# Altium schematic sheet ADCS2Umb.SchDoc
size A
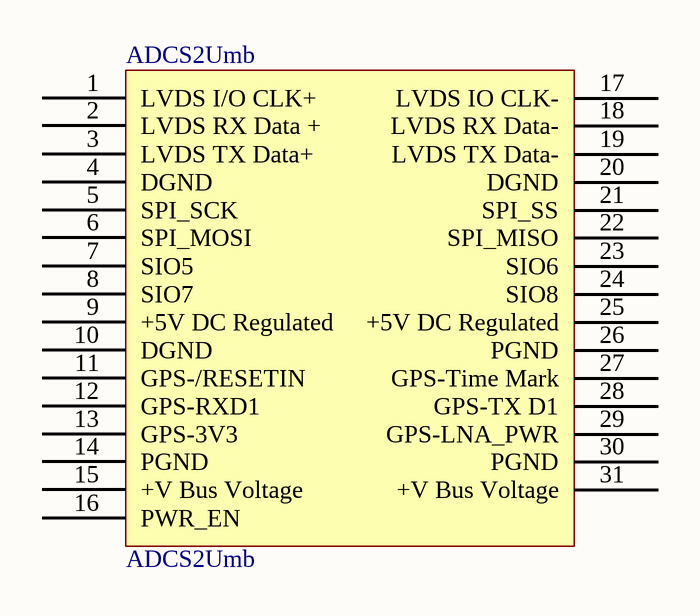
[diagram p0: ADCS2Umb.SchDoc]

## Parts
ADCS2Umb  ADCS2Umb  [ADCS2Umb]

## Nets

Not connected (* = marked no-connect by the designer): ADCS2Umb 1(LVDS_I/O_CLK+) 2(LVDS_RX_Data_+) 3(LVDS_TX_Data+) 4(DGND) 5(SPI_SCK) 6(SPI_MOSI) 7(SIO5) 8(SIO7) 9(+5V_DC_Regulated) 10(DGND) 11(GPS-/RESETIN) 12(GPS-RXD1) 13(GPS-3V3) 14(PGND) 15(+V_Bus_Voltage) 16(PWR_EN) 17(LVDS_IO_CLK-) 18(LVDS_RX_Data-) 19(LVDS_TX_Data-) 20(DGND) 21(SPI_SS) 22(SPI_MISO) 23(SIO6) 24(SIO8) 25(+5V_DC_Regulated) 26(PGND) 27(GPS-Time_Mark) 28(GPS-TX_D1) 29(GPS-LNA_PWR) 30(PGND) 31(+V_Bus_Voltage)

## Library data of the parts
ADCS2Umb = XACT_Molex_40Pin: Part Number: 501571-4007